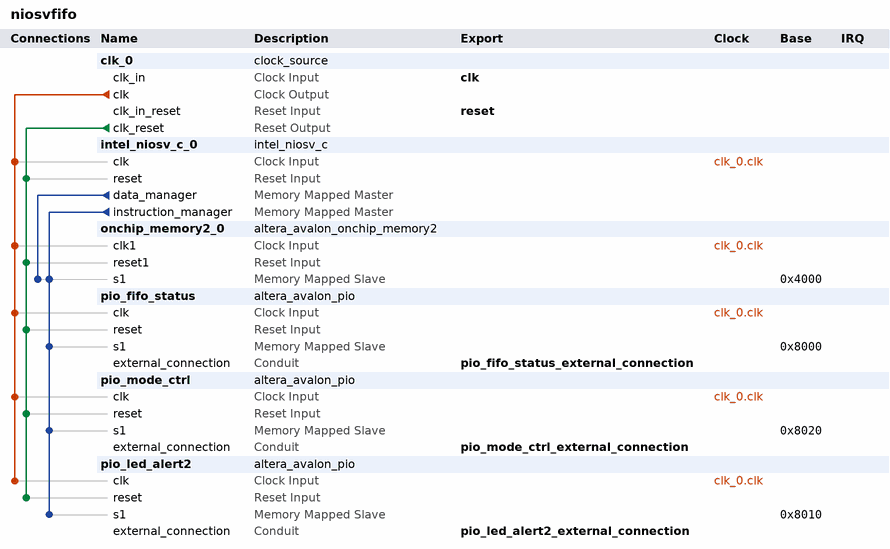
[diagram p0: system contents]
# Platform Designer (Qsys) system niosvfifo, Cyclone V 5CSEBA6U19C7
# Parameters at their usual value, and those the tool derives, are not listed.
package require -exact qsys 25.1
create_system niosvfifo
set_project_property DEVICE_FAMILY {Cyclone V}
set_project_property DEVICE 5CSEBA6U19C7

add_instance clk_0 clock_source 25.1
set_instance_parameter_value clk_0 clockFrequency 50000000

add_instance intel_niosv_c_0 intel_niosv_c 4.1.0
set_instance_parameter_value intel_niosv_c_0 archSize 32
set_instance_parameter_value intel_niosv_c_0 clockFrequency 50000000
set_instance_parameter_value intel_niosv_c_0 enableAvalonInterface true
set_instance_parameter_value intel_niosv_c_0 enableECCLite false
set_instance_parameter_value intel_niosv_c_0 enableResetReq false
set_instance_parameter_value intel_niosv_c_0 hartID 0
set_instance_parameter_value intel_niosv_c_0 numGpr 32
set_instance_parameter_value intel_niosv_c_0 resetOffset 0
set_instance_parameter_value intel_niosv_c_0 resetSlave onchip_memory2_0.s1
set_instance_parameter_value intel_niosv_c_0 useResetReq false

add_instance onchip_memory2_0 altera_avalon_onchip_memory2 25.1
set_instance_parameter_value onchip_memory2_0 dataWidth 32
set_instance_parameter_value onchip_memory2_0 dualPort false
set_instance_parameter_value onchip_memory2_0 initMemContent true
set_instance_parameter_value onchip_memory2_0 initializationFileName onchip_mem.hex
set_instance_parameter_value onchip_memory2_0 memorySize 16384

add_instance pio_fifo_status altera_avalon_pio 25.1
set_instance_parameter_value pio_fifo_status direction Input
set_instance_parameter_value pio_fifo_status width 16

add_instance pio_mode_ctrl altera_avalon_pio 25.1
set_instance_parameter_value pio_mode_ctrl direction Output
set_instance_parameter_value pio_mode_ctrl width 8

add_instance pio_led_alert2 altera_avalon_pio 25.1
set_instance_parameter_value pio_led_alert2 direction Output
set_instance_parameter_value pio_led_alert2 width 1

# connections
add_connection clk_0.clk intel_niosv_c_0.clk clock
add_connection clk_0.clk onchip_memory2_0.clk1 clock
add_connection clk_0.clk pio_fifo_status.clk clock
add_connection clk_0.clk pio_led_alert2.clk clock
add_connection clk_0.clk pio_mode_ctrl.clk clock
add_connection clk_0.clk_reset intel_niosv_c_0.reset reset
add_connection clk_0.clk_reset onchip_memory2_0.reset1 reset
add_connection clk_0.clk_reset pio_fifo_status.reset reset
add_connection clk_0.clk_reset pio_led_alert2.reset reset
add_connection clk_0.clk_reset pio_mode_ctrl.reset reset
add_connection intel_niosv_c_0.data_manager onchip_memory2_0.s1 avalon
set_connection_parameter_value intel_niosv_c_0.data_manager/onchip_memory2_0.s1 baseAddress 0x4000
add_connection intel_niosv_c_0.instruction_manager onchip_memory2_0.s1 avalon
set_connection_parameter_value intel_niosv_c_0.instruction_manager/onchip_memory2_0.s1 baseAddress 0x4000
add_connection intel_niosv_c_0.instruction_manager pio_fifo_status.s1 avalon
set_connection_parameter_value intel_niosv_c_0.instruction_manager/pio_fifo_status.s1 baseAddress 0x8000
add_connection intel_niosv_c_0.instruction_manager pio_led_alert2.s1 avalon
set_connection_parameter_value intel_niosv_c_0.instruction_manager/pio_led_alert2.s1 baseAddress 0x8010
add_connection intel_niosv_c_0.instruction_manager pio_mode_ctrl.s1 avalon
set_connection_parameter_value intel_niosv_c_0.instruction_manager/pio_mode_ctrl.s1 baseAddress 0x8020

# exported interfaces
add_interface clk clock sink
set_interface_property clk EXPORT_OF clk_0.clk_in
add_interface pio_fifo_status_external_connection conduit end
set_interface_property pio_fifo_status_external_connection EXPORT_OF pio_fifo_status.external_connection
add_interface pio_led_alert2_external_connection conduit end
set_interface_property pio_led_alert2_external_connection EXPORT_OF pio_led_alert2.external_connection
add_interface pio_mode_ctrl_external_connection conduit end
set_interface_property pio_mode_ctrl_external_connection EXPORT_OF pio_mode_ctrl.external_connection
add_interface reset reset sink
set_interface_property reset EXPORT_OF clk_0.clk_in_reset

set_interconnect_requirement {$system} qsys_mm.clockCrossingAdapter HANDSHAKE
set_interconnect_requirement {$system} qsys_mm.enableEccProtection FALSE
set_interconnect_requirement {$system} qsys_mm.insertDefaultSlave FALSE
set_interconnect_requirement {$system} qsys_mm.maxAdditionalLatency 1

save_system niosvfifo.qsys
